# Altium schematic sheet Spike and Hold V2.2.SchDoc
size A4
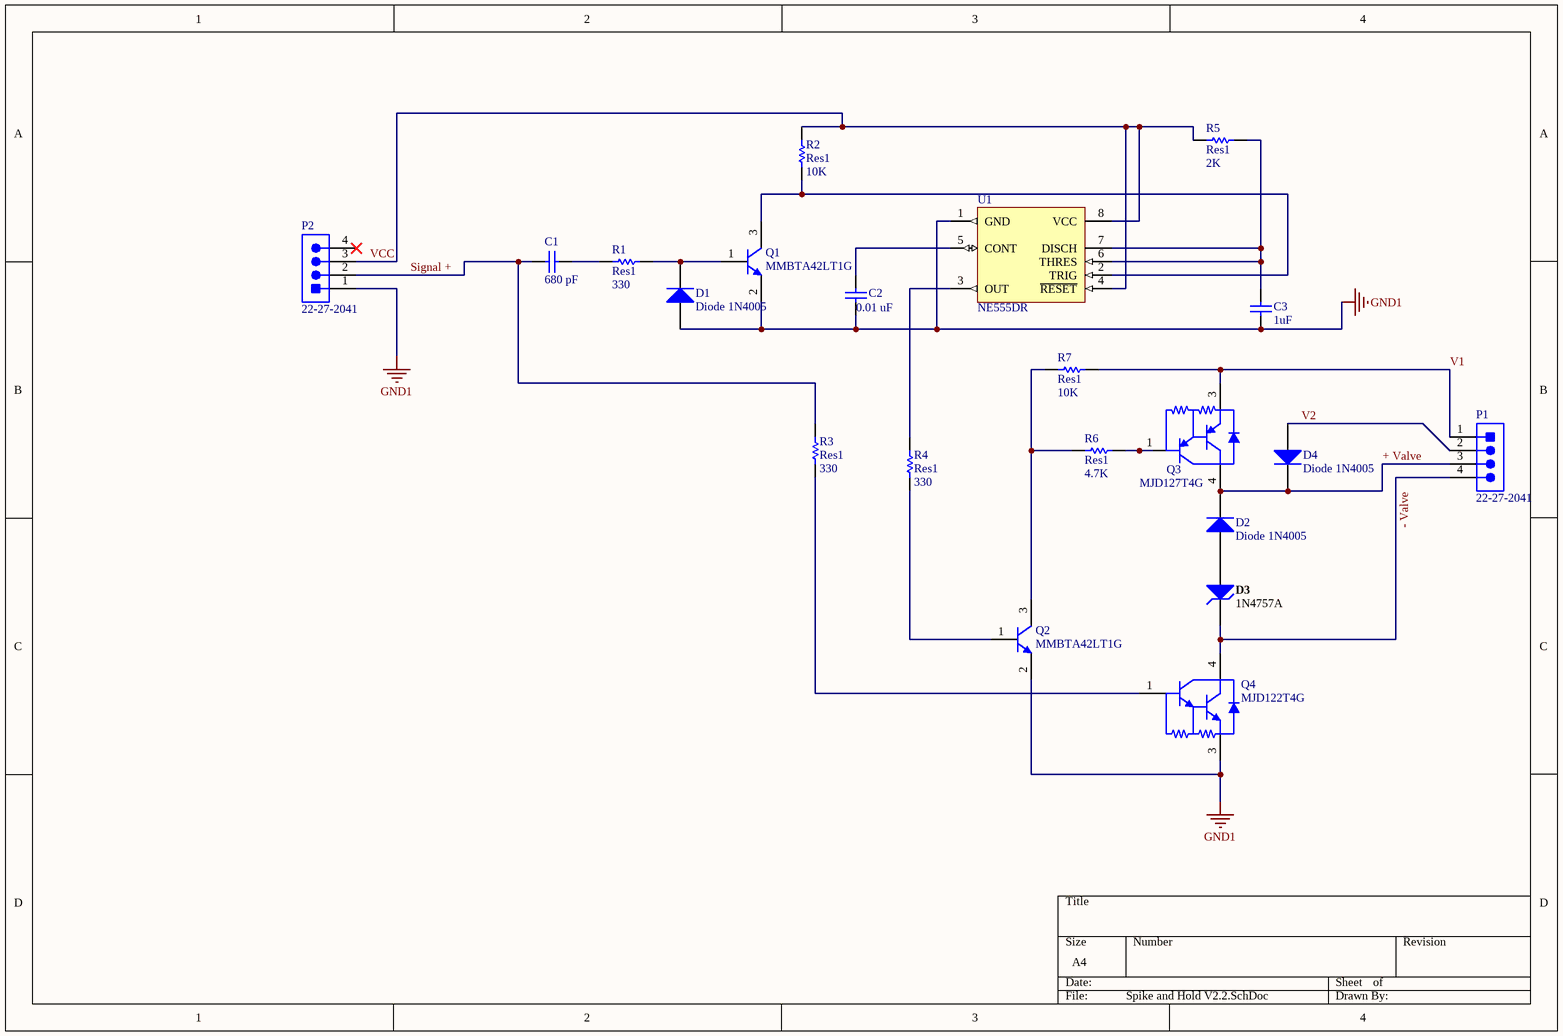
[diagram p0: Spike and Hold V2.2.SchDoc]

## Parts
C1  680 pF  [CAPC1005X55X30LL05T10]
C2  0.01 uF  [CAPC1608X87X35LL15T15]
C3  1uF  [CAPC1206(3216)110_L]
D1  Diode 1N4005  [DO-41]
D2  Diode 1N4005  [DO-41]
D3  1N4757A  [FAIR-DO-41-2_V]
D4  Diode 1N4005  [DO-41]
P1  22-27-2041  [MOLX-22-27-2041_V]
P2  22-27-2041  [MOLX-22-27-2041_V]
Q1  MMBTA42LT1G  [ONSC-SOT-23-3-318-08_V]
Q2  MMBTA42LT1G  [ONSC-SOT-23-3-318-08_V]
Q3  MJD127T4G  [ONSC-DPAK-3-369C-01_V]
Q4  MJD122T4G  [ONSC-DPAK-3-369C-01_V]
R1  Res1  value 330  [AXIAL-0.3]
R2  Res1  value 10K  [AXIAL-0.3]
R3  Res1  value 330  [AXIAL-0.3]
R4  Res1  value 330  [AXIAL-0.3]
R5  Res1  value 2K  [AXIAL-0.3]
R6  Res1  value 4.7K  [AXIAL-0.3]
R7  Res1  value 10K  [AXIAL-0.3]
U1  NE555DR  [D0008A_L]

## Nets
GND1: C2.1 C3.1 D1.1(A) P2.1 Q1.2(E) Q2.2(E) Q4.3(E) U1.1(GND)
+ Valve: D2.2(K) D4.2(K) P1.3 Q3.4(C)
- Valve: D3.2(K) P1.4 Q4.4(C)
Signal +: C1.1 P2.2 R3.2
V1: P1.1 Q3.3(E) R7.2
V2: D4.1(A) P1.2
VCC: P2.3 R2.2 R5.1 U1.4(~{RESET}) U1.8(VCC)
NetC1_2: C1.2 R1.1
NetC2_2: C2.2 U1.5(CONT)
NetC3_2: C3.2 R5.2 U1.6(THRES) U1.7(DISCH)
NetD1_2: D1.2(K) Q1.1(B) R1.2
NetD2_1: D2.1(A) D3.1(A)
NetQ1_3: Q1.3(C) R2.1 U1.2(TRIG)
NetQ2_1: Q2.1(B) R4.1
NetQ2_3: Q2.3(C) R6.1 R7.1
NetQ3_1: Q3.1(B) R6.2
NetQ4_1: Q4.1(B) R3.1
NetR4_2: R4.2 U1.3(OUT)

Not connected (* = marked no-connect by the designer): P2 4*

## Library data of the parts
C1 = CMP-2008-03245-1: Part Number: C0402C681K5RACTU; Manufacturer: Kemet
C2 = CMP-2006-03044-1: Part Number: C0603C103K5RACTU; Manufacturer: Kemet
C3 = CMP-1037-04718-1: CAP 1uF 50V ±10% 1206 (3216 Metric) Thickness 1.1mm SMD; Tolerance: Â±10%; Case-EIA: 1206; Case-Metric: 3216; Rated Voltage: 50 V; Max Thickness: 1.1 mm; Value: 1uF; Technology: SMT
D1 D2 D4 = Diode 1N4005: 1 Amp General Purpose Rectifier; Published: 8-Jun-2000; LatestRevisionDate: 17-Jul-2002; LatestRevisionNote: Re-released for DXP Platform.; DatasheetVersion: 1998; PackageVersion: Aug-1999; PackageReference: DO-41; Publisher: Altium Limited; PackageDescription: Diode, Axial; Body 5.2 x 2.7 mm (LxDia. max), Lead Dia. 0.86 mm (max); Code_JEDEC: DO-204-AL; ComponentLink1Description: Manufacturer Link; ComponentLink1URL: http://www.fairchildsemi.com/; ComponentLink2Description: Datasheet; ComponentLink2URL: http://www.fairchildsemi.com/ds/1N%2F1N4001.pdf
D3 = CMP-0892-00018-1: Zener Diode, 51V, 1W, 5%, -65 to 200 degC, 2-Pin DO-41, Body 2.72 x 5.2 mm, RoHS; Manufacturer: Fairchild Semiconductor; Test Current IZ (mA): 5; ZZ (Max) (ohm): 95; VZ (Min.) (V): 48.45; VZ (Max.) (V): 53.55; PD (W): 1; Mounting Technology: Through Hole; ComponentLink2Description: Datasheet; ComponentLink1Description: Manufacturer URL; ComponentLink2URL: http://www.fairchildsemi.com/ds/1N/1N4744A.pdf; PackageReference: DO-41-2; PartNumber: 1N4757A; Tolerance: 5%; ComponentLink3URL: http://www.fairchildsemi.com/dwg/DO/DO41A.pdf; IR (uA): 5; PackageDescription: 2-Pin Axial leaded, Body 2.72 x 5.2 mm, Lead Spread 25.4 mm; ComponentLink3Description: Package Specification; RoHS: TRUE; DatasheetVersion: Rev. H3; ComponentLink1URL: http://www.fairchildsemi.com/; PackageVersion: Rev. 2; Operating and Storage Temperature Range: -65 to 200 degC
P1 P2 = CMP-2000-05243-1: Male Header, Pitch 2.54 mm, 1 x 4 Position, Height 11.7 mm, Tail Length 3.56 mm, RoHS, Bulk; Manufacturer: Molex; Voltage rating: 250V; Current rating: 4A; Datasheet Version: Rev. F, 06/2009; Operating temperature: 0degCto+75degC; Contact material: Tinplatedbrass; Manufacturer URL: http://www.molex.com/; Housing material: Nylon(UL94V-0); Datasheet URL: http://www.molex.com/pdm_docs/sd/022272041_sd.pdf
Q1 Q2 = CMP-1048-00662-1: High Voltage Transistor, NPN Silicon, 3-Pin SOT-23, Pb-Free, Tape and Reel; Manufacturer: On Semiconductor; fT Min (MHz): 50; IC Continuous (A): 0.5; ComponentLink1URL: http://www.onsemi.com/; ComponentLink3URL: http://www.onsemi.cn/pub_link/Collateral/318-08.PDF; RoHS: TRUE; ComponentLink2Description: Datasheet; PartNumber: MMBTA42LT1G; Polarity: NPN; DatasheetVersion: Rev. 12; PackageReference: SOT-23-3-318-08; PackageDescription: 3-Pin Small Outline Transistor, Body 2.92 x 1.3 mm, Pitch 0.95 mm; ComponentLink3Description: Package Specification; ComponentLink1Description: Manufacturer URL; Packing: Tape and Reel; PackageVersion: Rev. AP, 11/2009; Mounting Technology: Surface Mount; ComponentLink2URL: http://www.onsemi.cn/pub_link/Collateral/MMBTA42LT1-D.PDF
Q3 = CMP-1047-00009-1: Complementary Darlington Power Transistor, 3-Pin DPAK, Pb-Free, Tape and Reel; Manufacturer: On Semiconductor; Polarity: PNP; IC Continuous (A): 8; hFE Max (k): 12; ComponentLink3URL: http://www.onsemi.cn/pub_link/Collateral/369C.PDF; PackageReference: DPAK-3-369C-01; RoHS: TRUE; PartNumber: MJD127T4G; ComponentLink2URL: http://www.onsemi.com/pub_link/Collateral/MJD122-D.PDF; PackageDescription: 3-Pin Flange Mount, Body 6.54 x 6.095 mm, Pitch 2.29 mm; Mounting Technology: Surface Mount; Packing: Tape and Reel; DatasheetVersion: Rev. 13; ComponentLink2Description: Datasheet; ComponentLink3Description: Package Specification; ComponentLink1URL: http://www.onsemi.com/; ComponentLink1Description: Manufacturer URL; PackageVersion: Rev. E, 02/2014
Q4 = CMP-1047-00007-1: Complementary Darlington Power Transistor, 3-Pin DPAK, Pb-Free, Tape and Reel; Manufacturer: On Semiconductor; IC Continuous (A): 8; hFE Max (k): 12; Polarity: NPN; ComponentLink1Description: Manufacturer URL; ComponentLink3URL: http://www.onsemi.cn/pub_link/Collateral/369C.PDF; Mounting Technology: Surface Mount; RoHS: TRUE; ComponentLink2Description: Datasheet; ComponentLink1URL: http://www.onsemi.com/; ComponentLink3Description: Package Specification; DatasheetVersion: Rev. 13; PackageDescription: 3-Pin Flange Mount, Body 6.54 x 6.095 mm, Pitch 2.29 mm; PartNumber: MJD122T4G; ComponentLink2URL: http://www.onsemi.com/pub_link/Collateral/MJD122-D.PDF; PackageVersion: Rev. E, 02/2014; PackageReference: DPAK-3-369C-01; Packing: Tape and Reel
R1-R7 = Res1: Resistor; Published: 8-Jun-2000; LatestRevisionDate: 17-Jul-2002; LatestRevisionNote: Re-released for DXP Platform.; PackageReference: AXIAL-0.3; Publisher: Altium Limited; PackageDescription: Axial Device, Thru-Hole; 2 Leads; 0.3 in Pin Spacing
U1 = CMP-1685-00007-1: Precision Timer, 4.5 to 16 V, 0 to 70 degC, 8-Pin SOIC (D8), Green (RoHS & no Sb/Br), Tape and Reel; Forward Voltage: 450 mV; Forward Current: 1 A; Max Surge Current: 30 A; Peak Reverse Current: 500 uA; Case\Package: SMA; PackageReference: D0008A; Width: 2.84 mm; PackageDescription: 8-Pin Small Outline Integrated Circuit, Body 4.9 x 3.9 mm, Pitch 1.27 mm; DatasheetVersion: SLFS022I, 09/2014; ComponentLink2Description: Datasheet; Package Quantity: 1; REACH SVHC: Unknown; Radiation Hardening: No; Height: 2.44 mm; Code_JEDEC: MS-012; Pins: 2; ComponentLink1Description: Manufacturer URL; ComponentLink3Description: Package Specification; ComponentLink3URL: http://www.ti.com/lit/ml/msoi002j/msoi002j.pdf; Length: 4.57 mm; ComponentLink1URL: http://www.ti.com/; Mount: Surface Mount; PackageVersion: 4040047-3/M, 06/2011; ComponentLink2URL: http://www.ti.com/general/docs/lit/getliterature.tsp?genericPartNumber=NE555&fileType=pdf; RoHSCompliant: true; Max Operating Temperature: 125 degC; Packaging: Cut Tape; Min Operating Temperature: -55 degC